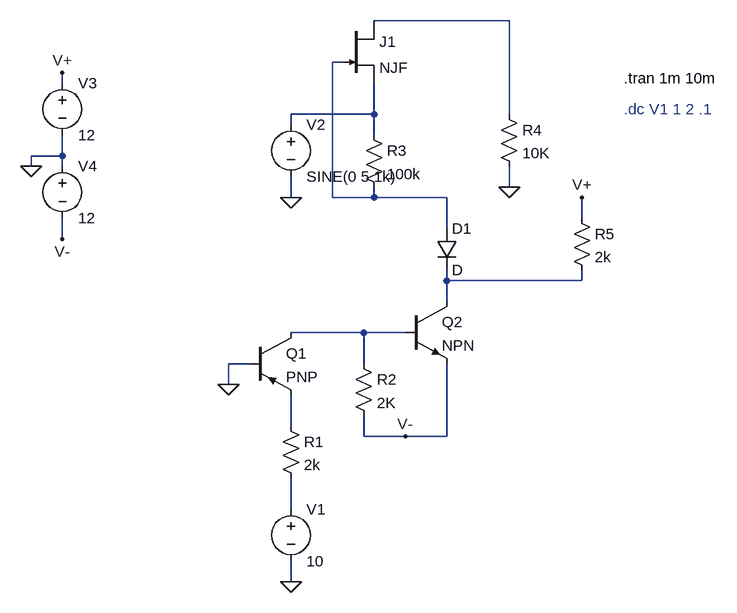
[diagram p0: schematic jfet-analog-switch.asc]
jfet-analog-switch.asc, the LTspice schematic file:
Version 4
SHEET 1 980 784
WIRE 640 -96 432 -96
WIRE 384 -32 368 -32
WIRE -48 0 -48 -16
WIRE 432 48 432 0
WIRE 432 48 304 48
WIRE 640 48 640 -96
WIRE 304 64 304 48
WIRE 432 80 432 48
WIRE -48 112 -48 80
WIRE -48 112 -96 112
WIRE -96 128 -96 112
WIRE -48 128 -48 112
WIRE 640 160 640 128
WIRE 304 176 304 144
WIRE 368 176 368 -32
WIRE 432 176 432 160
WIRE 432 176 368 176
WIRE 544 176 432 176
WIRE 752 208 752 176
WIRE 544 224 544 176
WIRE -48 240 -48 208
WIRE 544 304 544 288
WIRE 752 304 752 288
WIRE 752 304 544 304
WIRE 544 336 544 304
WIRE 416 384 304 384
WIRE 480 384 416 384
WIRE 240 432 208 432
WIRE 416 432 416 384
WIRE 208 464 208 432
WIRE 304 528 304 480
WIRE 416 544 416 512
WIRE 480 544 416 544
WIRE 544 544 544 432
WIRE 544 544 480 544
WIRE 304 656 304 608
WIRE 304 768 304 736
FLAG 304 768 0
FLAG 304 176 0
FLAG 640 160 0
FLAG 208 464 0
FLAG -96 128 0
FLAG -48 240 V-
FLAG -48 -16 V+
FLAG 480 544 V-
FLAG 752 176 V+
SYMBOL voltage 304 640 R0
SYMATTR InstName V1
SYMATTR Value 10
SYMBOL voltage 304 48 R0
SYMATTR InstName V2
SYMATTR Value SINE(0 5 1k)
SYMBOL res 288 512 R0
SYMATTR InstName R1
SYMATTR Value 2k
SYMBOL res 400 416 R0
SYMATTR InstName R2
SYMATTR Value 2K
SYMBOL res 416 64 R0
SYMATTR InstName R3
SYMATTR Value 100k
SYMBOL res 624 32 R0
SYMATTR InstName R4
SYMATTR Value 10K
SYMBOL res 736 192 R0
SYMATTR InstName R5
SYMATTR Value 2k
SYMBOL pnp 240 384 R0
SYMATTR InstName Q1
SYMBOL npn 480 336 R0
SYMATTR InstName Q2
SYMBOL njf 384 -96 R0
SYMATTR InstName J1
SYMBOL diode 528 224 R0
SYMATTR InstName D1
SYMBOL voltage -48 -16 R0
SYMATTR InstName V3
SYMATTR Value 12
SYMBOL voltage -48 112 R0
SYMATTR InstName V4
SYMATTR Value 12
TEXT 816 -8 Left 2 !.tran 1m 10m
TEXT 816 40 Left 2 ;.dc V1 1 2 .1

The netlist it stands for:
* jfet-analog-switch.asc
V1 N007 0 10
V2 N003 0 SINE(0 5 1k)
R1 N006 N007 2k
R2 N005 V- 2K
R3 N003 N002 100k
R4 N001 0 10K
R5 V+ N004 2k
Q1 N005 0 N006 0 PNP
Q2 N004 N005 V- 0 NPN
J1 N001 N002 N003 NJF
D1 N002 N004 D
V3 V+ 0 12
V4 0 V- 12
.model D D
.lib standard.dio
.model NPN NPN
.model PNP PNP
.lib standard.bjt
.model NJF NJF
.model PJF PJF
.lib standard.jft
.tran 1m 10m
* .dc V1 1 2 .1
.backanno
.end